# Altium schematic sheet 模拟均衡器.SchDoc: LX521 ASP Circuit
size A4; Revision: Rev 0
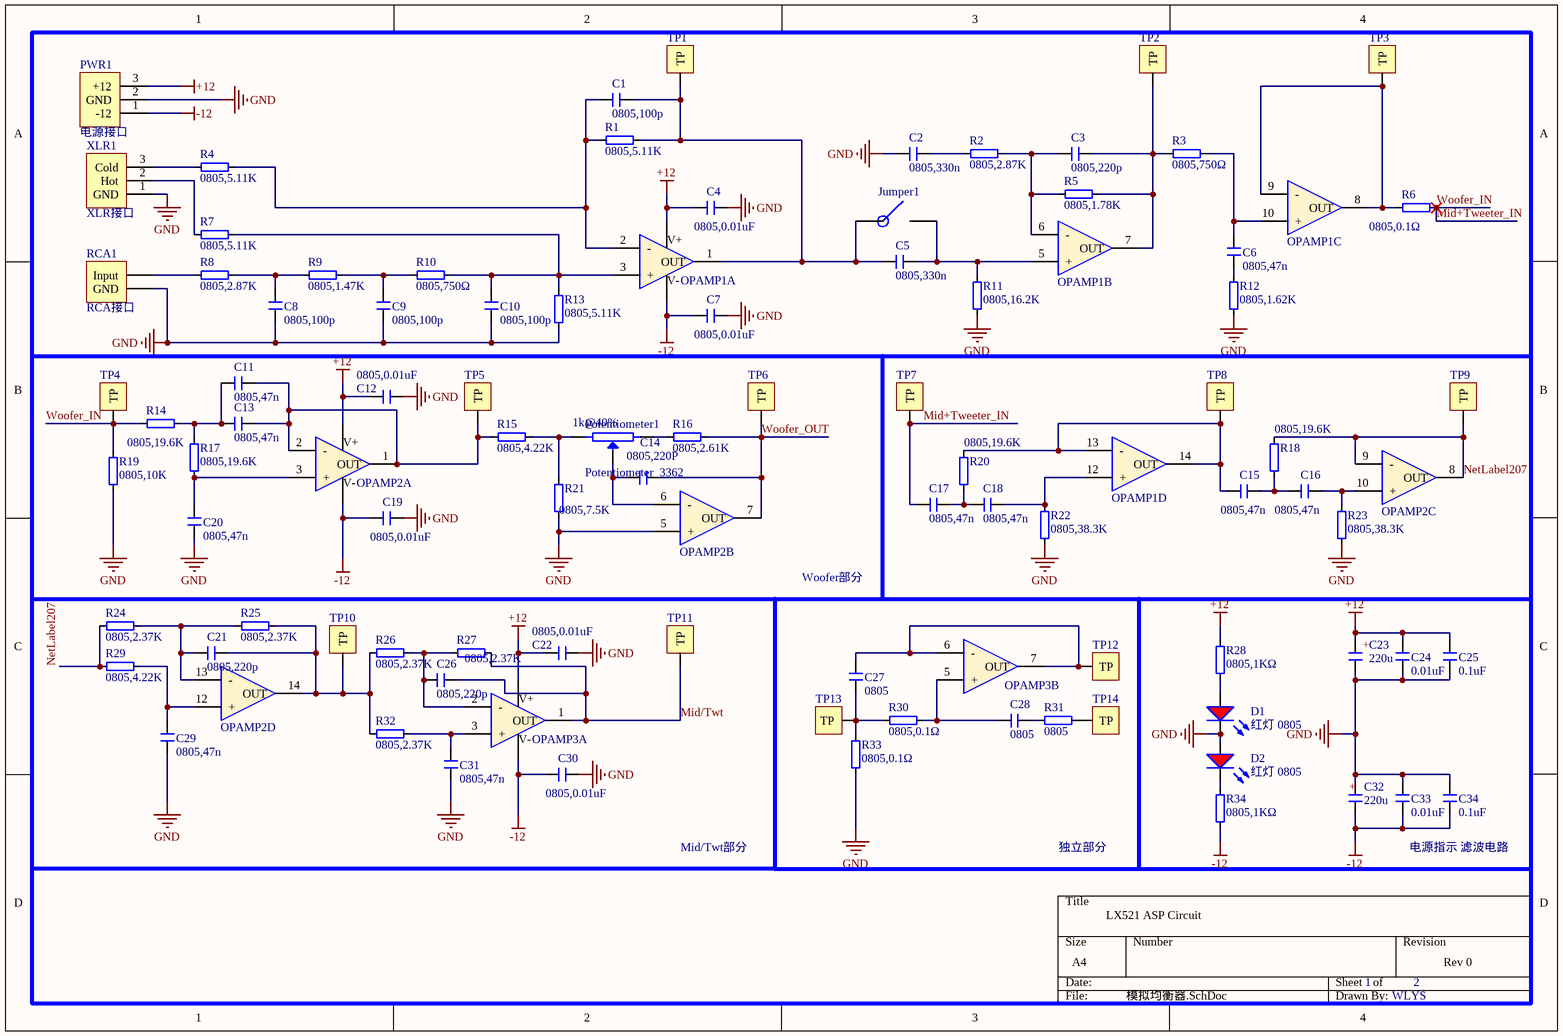
[diagram p0: 模拟均衡器.SchDoc]

## Parts
C1  0805,100p  [0805_C]
C2  0805,330n  [0805_C]
C3  0805,220p  [0805_C]
C4  0805,0.01uF  [0805_C]
C5  0805,330n  [0805_C]
C6  0805,47n  [0805_C]
C7  0805,0.01uF  [0805_C]
C8  0805,100p  [0805_C]
C9  0805,100p  [0805_C]
C10  0805,100p  [0805_C]
C11  0805,47n  [0805_C]
C12  0805,0.01uF  [0805_C]
C13  0805,47n  [0805_C]
C14  0805,220P  [0805_C]
C15  0805,47n  [0805_C]
C16  0805,47n  [0805_C]
C17  0805,47n  [0805_C]
C18  0805,47n  [0805_C]
C19  0805,0.01uF  [0805_C]
C20  0805,47n  [0805_C]
C21  0805,220p  [0805_C]
C22  0805,0.01uF  [0805_C]
C23  220u
C24  0.01uF  [0805_C]
C25  0.1uF  [0805_C]
C26  0805,220p  [0805_C]
C27  0805  [0805_C]
C28  0805  [0805_C]
C29  0805,47n  [0805_C]
C30  0805,0.01uF  [0805_C]
C31  0805,47n  [0805_C]
C32  220u
C33  0.01uF  [0805_C]
C34  0.1uF  [0805_C]
D1  红灯 0805  [0805_LED_S3]
D2  红灯 0805  [0805_LED_S3]
Jumper1  Jumper  [0805_J]  (value not drawn)
OPAMP1  4277UA  (value not drawn)  (parts A,B,C,D of 4)
OPAMP2  4277UA  [SOIC-14_150mil]  (value not drawn)  (parts A,B,C,D of 4)
OPAMP3  4277UA  [SOIC-14_150mil]  (value not drawn)  (parts A,B of 4)
Potentiometer1  Potentiometer_3362  [3362P]
PWR1  电源接口
R1  0805,5.11K  [0805_R]
R2  0805,2.87K  [0805_R]
R3  0805,750Ω  [0805_R]
R4  0805,5.11K  [0805_R]
R5  0805,1.78K  [0805_R]
R6  0805,0.1Ω  [0805_R]
R7  0805,5.11K  [0805_R]
R8  0805,2.87K  [0805_R]
R9  0805,1.47K  [0805_R]
R10  0805,750Ω  [0805_R]
R11  0805,16.2K  [0805_R]
R12  0805,1.62K  [0805_R]
R13  0805,5.11K  [0805_R]
R14  0805,19.6K  [0805_R]
R15  0805,4.22K  [0805_R]
R16  0805,2.61K  [0805_R]
R17  0805,19.6K  [0805_R]
R18  0805,19.6K  [0805_R]
R19  0805,10K  [0805_R]
R20  0805,19.6K  [0805_R]
R21  0805,7.5K  [0805_R]
R22  0805,38.3K  [0805_R]
R23  0805,38.3K  [0805_R]
R24  0805,2.37K  [0805_R]
R25  0805,2.37K  [0805_R]
R26  0805,2.37K  [0805_R]
R27  0805,2.37K  [0805_R]
R28  0805,1KΩ  [0805_R]
R29  0805,4.22K  [0805_R]
R30  0805,0.1Ω  [0805_R]
R31  0805  [0805_R]
R32  0805,2.37K  [0805_R]
R33  0805,0.1Ω  [0805_R]
R34  0805,1KΩ  [0805_R]
RCA1  RCA接口  [XH2.54-LI-2P]
TP1  测试点  [TestPoint]  (value not drawn)
TP2  测试点  [TestPoint]  (value not drawn)
TP3  测试点  [TestPoint]  (value not drawn)
TP4  测试点  [TestPoint]  (value not drawn)
TP5  测试点  [TestPoint]  (value not drawn)
TP6  测试点  [TestPoint]  (value not drawn)
TP7  测试点  [TestPoint]  (value not drawn)
TP8  测试点  [TestPoint]  (value not drawn)
TP9  测试点  [TestPoint]  (value not drawn)
TP10  测试点  [TestPoint]  (value not drawn)
TP11  测试点  [TestPoint]  (value not drawn)
TP12  测试点  [TestPoint]  (value not drawn)
TP13  测试点  [TestPoint]  (value not drawn)
TP14  测试点  [TestPoint]  (value not drawn)
XLR1  XLR接口

## Nets
+12: C4.1 C12.1 C22.1 C23.1 C24.2 C25.2 OPAMP1.4(V+) OPAMP2.4(V+) OPAMP3.4(V+) PWR1.3(+12) R28.1
-12: C7.1 C19.1 C30.1 C32.2 C33.1 C34.1 OPAMP1.11(V-) OPAMP2.11(V-) OPAMP3.11(V-) PWR1.1(-12) R34.2
GND: C2.1 C4.2 C7.2 C8.2 C9.2 C10.2 C12.2 C19.2 C20.1 C22.2 C23.2 C24.1 C25.1 C29.1 C30.2 C31.1 C32.1 C33.2 C34.2 D1.K D2.A OPAMP2.5(+) PWR1.2(GND) R11.1 R12.1 R13.1 R19.1 R21.2 R22.1 R23.1 R33.2 RCA1.2(GND) XLR1.1(GND)
Mid+Tweeter_IN: C17.1 R6.2 R14.1 R19.2 TP4.1(TP) TP7.1(TP)  [also labelled Woofer_IN]
Mid/Twt: C26.1 OPAMP3.1(OUT) R27.1 TP11.1(TP)
NetLabel207: OPAMP2.8(OUT) OPAMP2.9(-) R18.2 R24.2 R29.2 TP9.1(TP)
Woofer_OUT: C14.1 OPAMP2.7(OUT) R16.1 TP6.1(TP)
NetC1_1: C1.1 OPAMP1.2(-) R1.1 R4.2
NetC1_2: C1.2 C5.1 Jumper1.1 OPAMP1.1(OUT) R1.2 TP1.1(TP)
NetC2_2: C2.2 R2.1
NetC3_1: C3.1 OPAMP1.6(-) R2.2 R5.1
NetC3_2: C3.2 OPAMP1.7(OUT) R3.1 R5.2 TP2.1(TP)
NetC5_2: C5.2 Jumper1.2 OPAMP1.5(+) R11.2
NetC6_1: C6.1 R12.2
NetC6_2: C6.2 OPAMP1.10(+) R3.2
NetC8_1: C8.1 R8.2 R9.1
NetC9_1: C9.1 R9.2 R10.1
NetC10_1: C10.1 OPAMP1.3(+) R7.2 R10.2 R13.2
NetC11_1: C11.1 C13.1 OPAMP2.1(OUT) OPAMP2.2(-) R15.2 TP5.1(TP)
NetC11_2: C11.2 C13.2 R14.2 R17.2
NetC14_2: C14.2 OPAMP2.6(-) Potentiometer1.2(W)
NetC15_1: C15.1 C16.2 R18.1
NetC15_2: C15.2 OPAMP1.13(-) OPAMP1.14(OUT) R20.2 TP8.1(TP)
NetC16_1: C16.1 OPAMP2.10(+) R23.2
NetC17_2: C17.2 C18.1 R20.1
NetC18_2: C18.2 OPAMP1.12(+) R22.2
NetC20_2: C20.2 OPAMP2.3(+) R17.1
NetC21_1: C21.1 OPAMP2.14(OUT) R25.1 R26.2 R32.2 TP10.1(TP)
NetC21_2: C21.2 OPAMP2.13(-) R24.1 R25.2
NetC26_2: C26.2 OPAMP3.2(-) R26.1 R27.2
NetC27_1: C27.1 R30.2 R33.1 TP13.1(TP)
NetC27_2: C27.2 OPAMP3.6(-) OPAMP3.7(OUT) TP12.1(TP)
NetC28_1: C28.1 R31.2
NetC28_2: C28.2 OPAMP3.5(+) R30.1
NetC29_2: C29.2 OPAMP2.12(+) R29.1
NetC31_2: C31.2 OPAMP3.3(+) R32.1
NetD1_A: D1.A R28.2
NetD2_K: D2.K R34.1
NetOPAMP1_8: OPAMP1.8(OUT) OPAMP1.9(-) R6.1 TP3.1(TP)
NetPotentiometer1_1: Potentiometer1.1 R16.2
NetPotentiometer1_3: Potentiometer1.3 R15.1 R21.1
NetR4_1: R4.1 XLR1.3(Cold)
NetR7_1: R7.1 XLR1.2(Hot)
NetR8_1: R8.1 RCA1.1(Input)
NetR31_1: R31.1 TP14.1(TP)

## Notes on the sheet
- (near Potentiometer1) 1k@40%
- Woofer部分
- Mid/Twt部分
- 独立部分
- 电源指示 滤波电路
- LX521 ASP Circuit
- 1
- 2
- Rev 0
- WLYS
- (in symbol C直插电解) +

## Library data of the parts
C1-C3 C5 C6 C8-C11 C13-C18 C20 C21 C24-C26 C29 C31 C33 C34 = C0805
C4 C7 C12 C19 C22 C27 C28 C30 = C0805: 0.01uF
C23 C32 = C直插电解
D1 D2 = 0805 红灯: 发光二极管; ComponentLink1Description: 供应商链接; ComponentLink1URL: http://www.szlcsc.com/product/details_2668.html; Package: 0805; Supplier: LC; SuppliersPartNumber: C2295
OPAMP1-OPAMP3 = OPA4277UA
R1-R34 = R0805